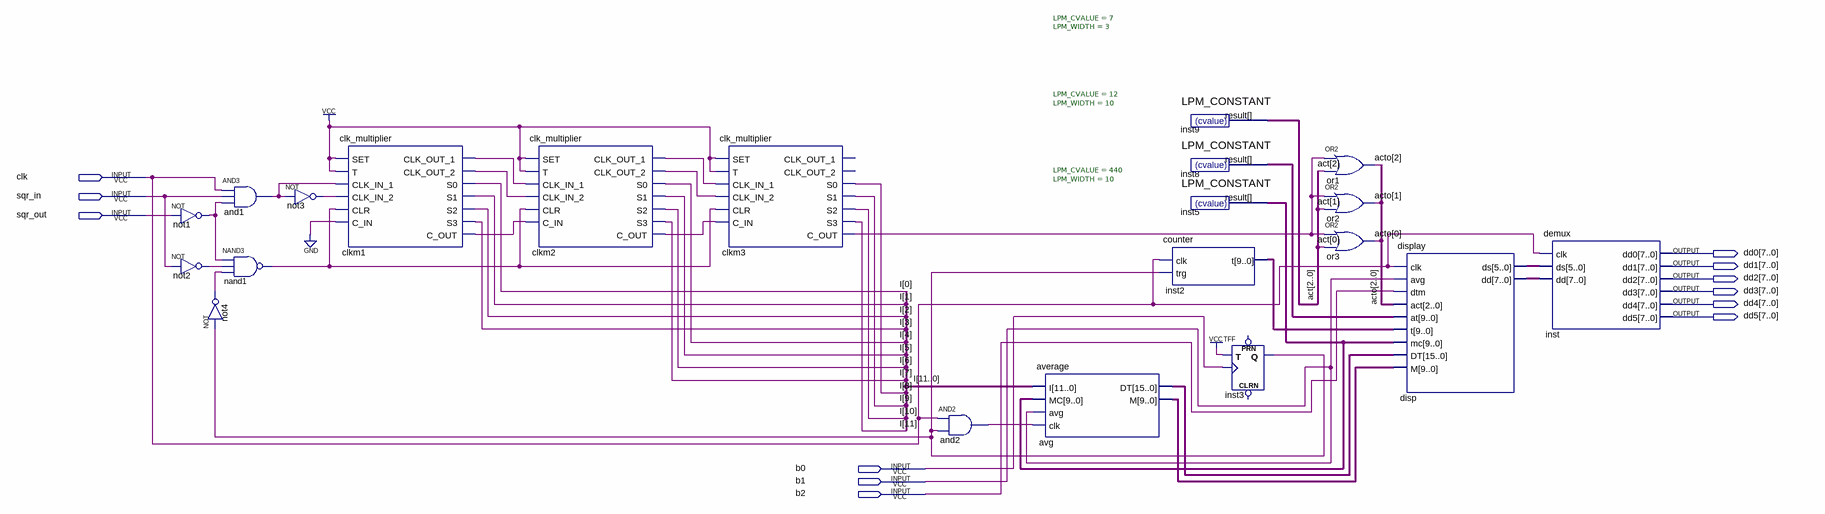
[diagram p0: schematic sheet]
// Quartus schematic nmm.bdf as structural Verilog: 21 symbols, 12 pins
module nmm (
  input  clk,
  input  sqr_in,
  input  sqr_out,
  input  b0,
  input  b1,
  input  b2,
  output [7:0] dd0,
  output [7:0] dd1,
  output [7:0] dd2,
  output [7:0] dd3,
  output [7:0] dd4,
  output [7:0] dd5
);

  wire and1_out, and2_out, clkm1_c_out, clkm1_clk_out_1, clkm1_clk_out_2, clkm2_c_out, clkm2_clk_out_1,
       clkm2_clk_out_2, clkm3_c_out, inst3_q, nand1_out, not1_out, not2_out, not3_out, not4_out;
  wire [2:0] act, acto;
  wire [5:0] disp_ds;
  wire [7:0] disp_dd;
  wire [9:0] avg_m, inst2_t, inst5_result, inst8_result;
  wire [11:0] I;
  wire [15:0] avg_dt;

  not not1 (not1_out, sqr_out);
  not not2 (not2_out, sqr_in);
  not not4 (not4_out, inst3_q);
  and and1 (and1_out, clk, sqr_in, not1_out);
  nand nand1 (nand1_out, not1_out, not2_out, not4_out);
  not not3 (not3_out, and1_out);
  clk_multiplier clkm1 (
    .SET(1'b1), .T(1'b1), .CLK_IN_1(and1_out), .CLK_IN_2(not3_out), .CLR(nand1_out), .C_IN(1'b0),
    .CLK_OUT_1(clkm1_clk_out_1), .CLK_OUT_2(clkm1_clk_out_2), .S3(I[3]), .C_OUT(clkm1_c_out), .S0(I[0]),
    .S1(I[1]), .S2(I[2]));
  clk_multiplier clkm2 (
    .SET(1'b1), .T(1'b1), .CLK_IN_1(clkm1_clk_out_1), .CLK_IN_2(clkm1_clk_out_2), .CLR(nand1_out),
    .C_IN(clkm1_c_out), .CLK_OUT_1(clkm2_clk_out_1), .CLK_OUT_2(clkm2_clk_out_2), .S3(I[7]),
    .C_OUT(clkm2_c_out), .S0(I[4]), .S1(I[5]), .S2(I[6]));
  clk_multiplier clkm3 (
    .SET(1'b1), .T(1'b1), .CLK_IN_1(clkm2_clk_out_1), .CLK_IN_2(clkm2_clk_out_2), .CLR(nand1_out),
    .C_IN(clkm2_c_out), .S3(I[11]), .C_OUT(clkm3_c_out), .S0(I[8]), .S1(I[9]), .S2(I[10]));  // open: CLK_OUT_1, CLK_OUT_2
  and and2 (and2_out, clk, inst3_q);
  average avg (.I(I), .MC(inst5_result), .avg(b1), .clk(and2_out), .DT(avg_dt), .M(avg_m));
  counter inst2 (.clk(clk), .trg(inst3_q), .t(inst2_t));
  LPM_CONSTANT #(.LPM_CVALUE(7), .LPM_WIDTH(3)) inst9 (.result(act));
  LPM_CONSTANT #(.LPM_CVALUE(12), .LPM_WIDTH(10)) inst8 (.result(inst8_result));
  LPM_CONSTANT #(.LPM_CVALUE(440), .LPM_WIDTH(10)) inst5 (.result(inst5_result));
  TFF inst3 (.T(1'b1), .CLK(b0), .Q(inst3_q));  // open: PRN, CLRN
  or or1 (acto[2], clkm3_c_out, act[2]);
  or or2 (acto[1], clkm3_c_out, act[1]);
  or or3 (acto[0], clkm3_c_out, act[0]);
  display disp (
    .clk(clk), .avg(b1), .dtm(b2), .act(acto), .at(inst8_result), .t(inst2_t), .mc(inst5_result),
    .DT(avg_dt), .M(avg_m), .ds(disp_ds), .dd(disp_dd));
  demux inst (.clk(clk), .ds(disp_ds), .dd(disp_dd), .dd0(dd0), .dd1(dd1), .dd2(dd2), .dd3(dd3), .dd4(dd4), .dd5(dd5));
endmodule
